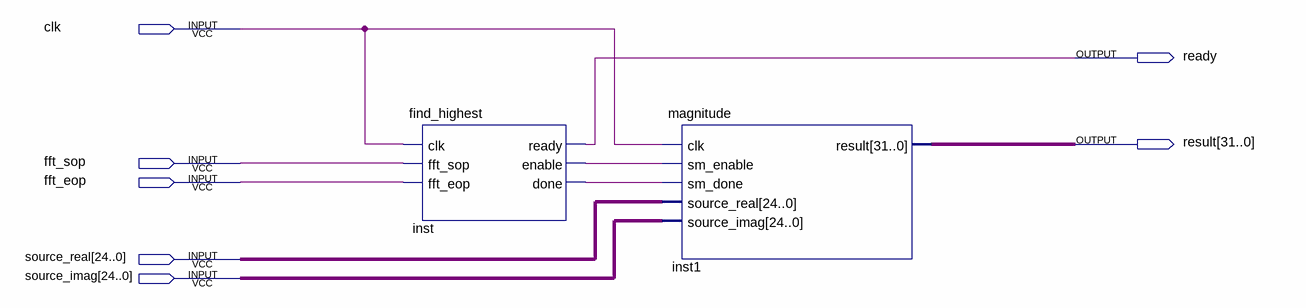
[diagram p0: schematic sheet]
// Quartus schematic magnitude_calculation.bdf as structural Verilog: 2 symbols, 7 pins
module magnitude_calculation (
  input  clk,
  input  fft_sop,
  input  fft_eop,
  input  [24:0] source_real,
  input  [24:0] source_imag,
  output ready,
  output [31:0] result
);

  wire inst_done, inst_enable;

  find_highest inst (
    .clk(clk), .fft_sop(fft_sop), .fft_eop(fft_eop), .ready(ready), .enable(inst_enable), .done(inst_done));
  magnitude inst1 (
    .clk(clk), .sm_enable(inst_enable), .sm_done(inst_done), .source_real(source_real),
    .source_imag(source_imag), .result(result));
endmodule
